# Altium schematic sheet Sensor_ExpandBoard_IR.SchDoc: Sencor Card
size A4; Revision: V1.1; SheetNumber: 4; SheetTotal: 7; Function: IR
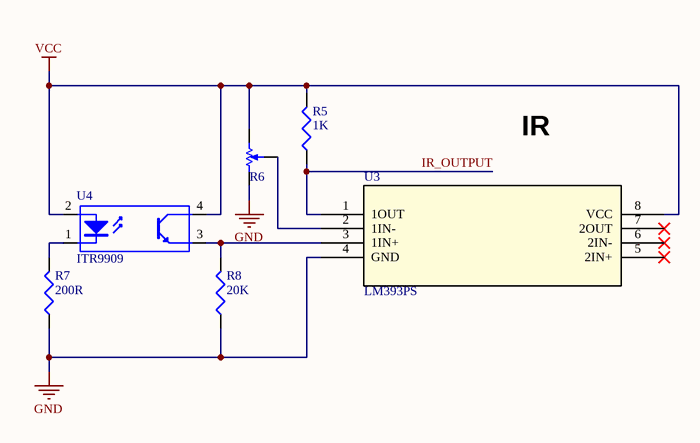
[diagram p0: Sensor_ExpandBoard_IR.SchDoc]

## Parts
R5  1K  [R0603]
R6  10K  [POT4MM-2]  (value not drawn)
R7  200R  [R0603]
R8  20K  [R0603]
U3  LM393PS  [PS8]
U4  ITR9909  [IR_PAIRED_TUBE]

## Nets
GND: R6.CCW(-) R7.1 R8.1 U3.4(GND)
VCC: R5.2 R6.CW(+) U3.8(VCC) U4.2(A) U4.4(C)
IR_OUTPUT: R5.1 U3.1(1OUT)
NetR6_W: R6.W U3.2(1IN-)
NetR7_2: R7.2 U4.1(K)
NetR8_2: R8.2 U3.3(1IN+) U4.3(E)

Not connected (* = marked no-connect by the designer): U3 5(2IN+)* 6(2IN-)* 7(2OUT)*

## Notes on the sheet
- IR
- 工程名称：
- 图纸大小：
- 日期：
- A4
- 版本号：
- 页码：
- 第
- 共
- 制图：
- 审核：

## Library data of the parts
R5 R7 R8 = Res: Resistor; Published: 8-Jun-2000; LatestRevisionDate: 29-May-2009; LatestRevisionNote: IPC-7351 Footprint Added.; PackageReference: J1-0603; Publisher: Altium Limited; PackageDescription: Chip Resistor
  R5: Value: 1K
  R7: Value: 200R
  R8: Value: 20K
R6 = RPot SM: 贴片可调电阻，3 x 3，4P; Published: 17-Dec-2003; DatasheetVersion: Oct-2003; PackageReference: POT4MM-2; Publisher: Altium Limited; PackageDescription: Square Trimming Potentiometer; ComponentLink1Description: Manufacturer Link; ComponentLink1URL: http://bourns.com/2/search.html; Value: 10K
U3 = LM393_PS_8: 双路差分比较器LM393; Manufacturer: Texas Instruments; GENERIC_PART_NUMBER: LM393; INDUSTRY_STD_PKG_TYPE: SO; FAMILY_NAME: COMPARATOR; PIN_COUNT: 8; PACKAGE_DESIGNATOR: PS; Datasheet_URL: http://www.ti.com/lit/gpn/LM393; Vendor: Texas Instruments; Manufacturer_Part_Number: lm393_ps_8; Value: LM393PS; Type: Type; RefDes: RefDes
U4 = Optoisolator1: 4-Pin Phototransistor Optocoupler; Published: 24-Mar-1999; LatestRevisionDate: 04-Mar-2005; LatestRevisionNote: Sch pins 3 & 4 Swapped.; DatasheetVersion: Nov-2003; PackageReference: DIP-4; Publisher: Altium Limited; Value: ITR9909